# EAGLE schematic Tail lights4 (EAGLE 8.3.2)
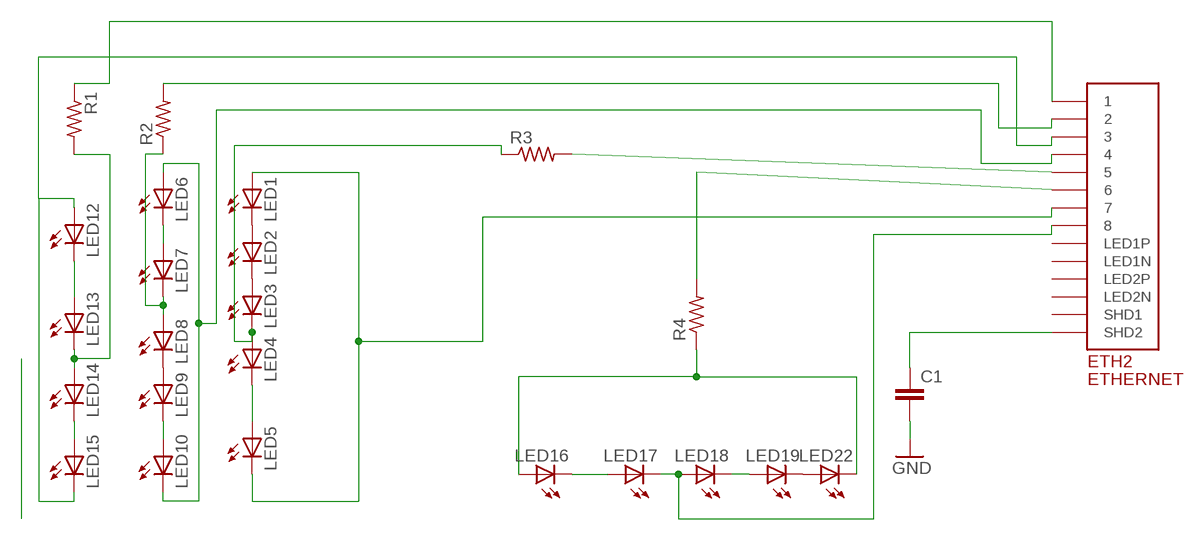
[diagram p0: schematic, sheet 1]

## Parts
C1  C2,5-3  [C2.5-3]
ETH2  ETHERNET  [A122645-ND]
LED1  LED  [SMARTLED-TTW]
LED2  LED  [SMARTLED-TTW]
LED3  LED  [SMARTLED-TTW]
LED4  LED  [SMARTLED-TTW]
LED5  LED  [SMARTLED-TTW]
LED6  LED  [SMARTLED-TTW]
LED7  LED  [SMARTLED-TTW]
LED8  LED  [SMARTLED-TTW]
LED9  LED  [SMARTLED-TTW]
LED10  LED  [SMARTLED-TTW]
LED12  LED  [SMARTLED-TTW]
LED13  LED  [SMARTLED-TTW]
LED14  LED  [SMARTLED-TTW]
LED15  LED  [SMARTLED-TTW]
LED16  LED  [SMARTLED-TTW]
LED17  LED  [SMARTLED-TTW]
LED18  LED  [SMARTLED-TTW]
LED19  LED  [SMARTLED-TTW]
LED22  LED  [SMARTLED-TTW]
R1  R-US_0204/5  [0204/5]
R2  R-US_0204/2V  [0204V]
R3  R-US_0204/2V  [0204V]
R4  R-US_0204/2V  [0204V]

## Nets
GND: C1.2
N$1: ETH2.P$7 LED1.A@1(A) LED5.C@1(C)
N$2: ETH2.P$4 LED6.A@1(A) LED10.C@1(C)
N$3: LED16.A@1(A) LED22.C@1(C) R4.1
N$4: LED1.C@1(C) LED2.A@1(A)
N$5: LED2.C@1(C) LED3.A@1(A)
N$6: ETH2.P$2 R2.2
N$7: LED4.C@1(C) LED5.A@1(A)
N$8: LED6.C@1(C) LED7.A@1(A)
N$9: LED7.C@1(C) LED8.A@1(A) R2.1
N$10: LED8.C@1(C) LED9.A@1(A)
N$11: LED9.C@1(C) LED10.A@1(A)
N$12: ETH2.P$3 LED12.A@1(A) LED15.C@1(C)
N$13: LED12.C@1(C) LED13.A@1(A)
N$14: LED13.C@1(C) LED14.A@1(A) R1.2
N$15: LED14.C@1(C) LED15.A@1(A)
N$16: LED16.C@1(C) LED17.A@1(A)
N$17: ETH2.P$8 LED17.C@1(C) LED18.A@1(A)
N$18: LED18.C@1(C) LED19.A@1(A)
N$20: C1.1 ETH2.P$14(SHD2)
N$21: ETH2.P$5 R3.2
N$22: ETH2.P$6 R4.2
N$23: LED19.C@1(C) LED22.A@1(A)
N$25: ETH2.P$1 R1.1
N$28: LED3.C@1(C) LED4.A@1(A) R3.1
Unconnected: ETH2.P$9(LED1N) ETH2.P$10(LED1P) ETH2.P$11(LED2N) ETH2.P$12(LED2P) ETH2.P$13(SHD1)

## Library data of the parts
C1 = capacitor-wima:C: CAPACITOR naming: grid - package width
ETH2 = ETHERNET:ETHERNET: Ethernet port with 2 leds. digikey number A122645-ND
LED1-LED10 LED12-LED19 LED22 = E-P-008-R1.2:LED: LED OSRAM: - CHIPLED LG R971, LG N971, LY N971, LG Q971, LY Q971, LO R971, LY R971 LH N974, LH R974 LS Q976, LO Q976, LY Q976 LO Q996 - Hyper CHIPLED LW Q18S LB Q993, LB Q99A, LB R99A - SideLED LS A670, LO A670, LY A670, LG A670, LP A670 LB A673, LV A673, LT A673, LW A673 LH A674 LY A675 LS A676, LA A676, LO A676, LY A676, LW A676 LS A679, LY A679, LG A679 - Hyper Micro SIDELED® LS Y876, LA Y876, LO Y876, LY Y876 LT Y87S - SmartLED LW L88C, LW L88S LB L89C, LB L89S, LG L890 LS L89K, LO L89K, LY L89K LS L896, LA L896, LO L896, LY L896 - TOPLED LS T670, LO T670, LY T670, LG T670, LP T670 LSG T670, LSP T670, LSY T670, LOP T670, LYG T670 LG T671, LOG T671, LSG T671 LB T673, LV T673, LT T673, LW T673 LH T674 LS T676, LA T676, LO T676, LY T676, LB T676, LH T676, LSB T676, LW T676 LB T67C, LV T67C, LT T67C, LS T67K, LO T67K, LY T67K, LW E67C LS E67B, LA E67B, LO E67B, LY E67B, LB E67C, LV E67C, LT E67C LW T67C LS T679, LY T679, LG T679 LS T770, LO T770, LY T770, LG T770, LP T770 LB T773, LV T773, LT T773, LW T773 LH T774 LS E675, LA E675, LY E675, LS T675 LS T776, LA T776, LO T776, LY T776, LB T776 LHGB T686 LT T68C, LB T68C - Hyper Mini TOPLED® LB M676 - Mini TOPLED Santana® LG M470 LS M47K, LO M47K, LY M47K Source: http://www.osram.convergy.de LUXEON: - LUMILED® LXK2-PW12-R00, LXK2-PW12-S00, LXK2-PW14-U00, LXK2-PW14-V00 LXK2-PM12-R00, LXK2-PM12-S00, LXK2-PM14-U00 LXK2-PE12-Q00, LXK2-PE12-R00, LXK2-PE12-S00, LXK2-PE14-T00, LXK2-PE14-U00 LXK2-PB12-K00, LXK2-PB12-L00, LXK2-PB12-M00, LXK2-PB14-N00, LXK2-PB14-P00, LXK2-PB14-Q00 LXK2-PR12-L00, LXK2-PR12-M00, LXK2-PR14-Q00, LXK2-PR14-R00 LXK2-PD12-Q00, LXK2-PD12-R00, LXK2-PD12-S00 LXK2-PH12-R00, LXK2-PH12-S00 LXK2-PL12-P00, LXK2-PL12-Q00, LXK2-PL12-R00 Source: www.luxeon.com KINGBRIGHT: KA-3528ASYC Source: www.kingbright.com
R1-R4 = resistor:R-US_: RESISTOR, American symbol